# EAGLE design object_1_milling (EAGLE 7.7.0)
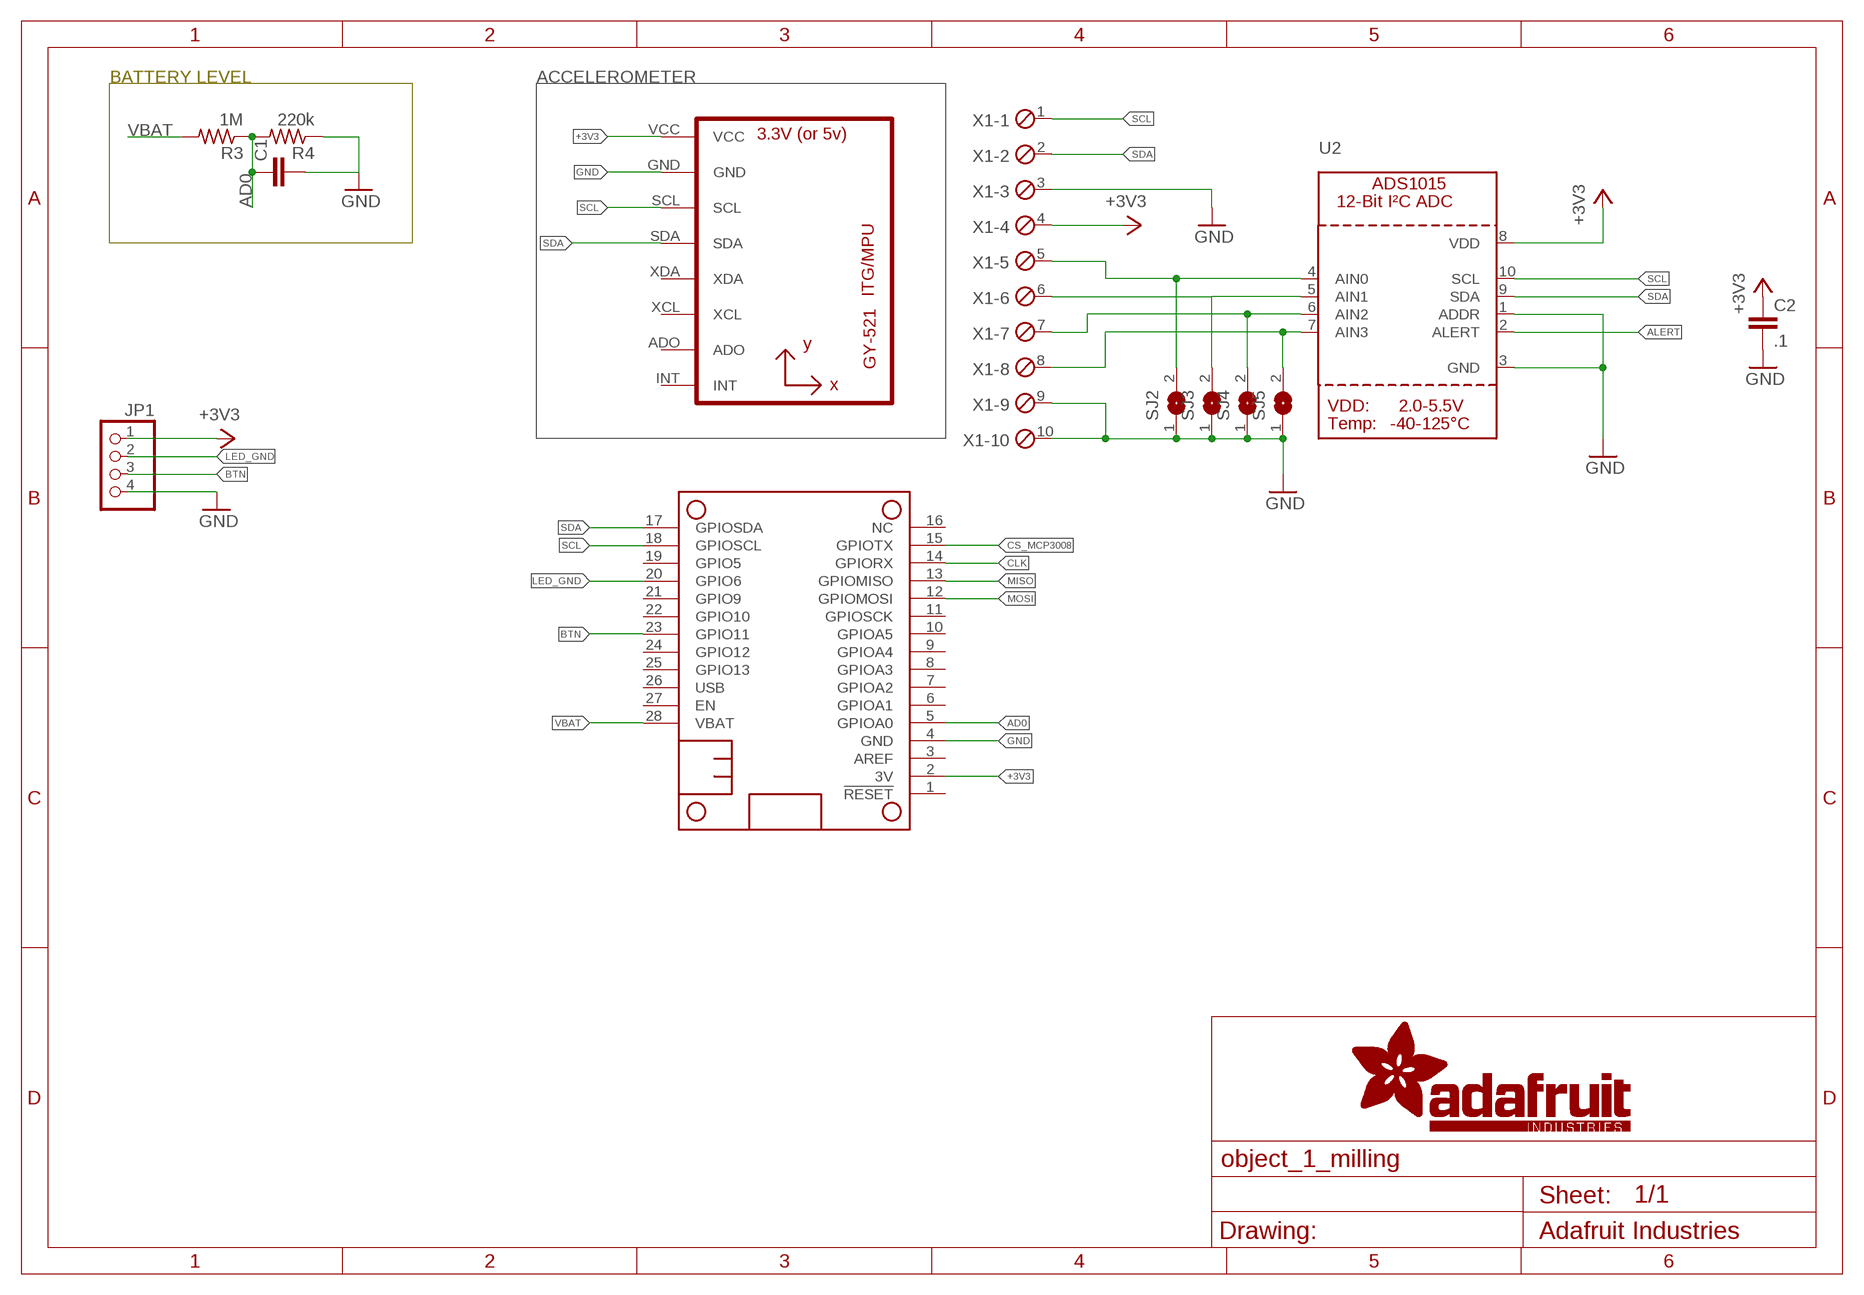
[diagram p0: schematic, sheet 1]

## Parts
C1  C-EUC0805K  [C0805K]
C2  .1  C-EUC0805K  [C0805K]
JP1  PINHD-1X4/90  [1X04/90]
MS1  FEATHERWING_NODIM  [FEATHERWING_DIM]
R3  1M  R-US_M0805  [M0805]
R4  220k  R-US_M0805  [M0805]
SJ2  SOLDERJUMPER  [SOLDERJUMPER_ARROW_NOPASTE]
SJ3  SOLDERJUMPER  [SOLDERJUMPER_ARROW_NOPASTE]
SJ4  SOLDERJUMPER  [SOLDERJUMPER_ARROW_NOPASTE]
SJ5  SOLDERJUMPER  [SOLDERJUMPER_ARROW_NOPASTE]
U1  GY-521MPU6050  [GY-521]
U2  ADC_ADS1015  [MSOP10]
X1  MPT10  [10POL254]

## Nets
+3V3: C2.1 JP1.1 MS1.2(3V) U1.VCC U2.8(VDD) X1.4
AD0: C1.1 MS1.5(GPIOA0) R3.1 R4.2
ALERT: U2.2(ALERT)
BTN: JP1.3 MS1.23(GPIO11)
CLK: MS1.14(GPIORX)
CS_MCP3008: MS1.15(GPIOTX)
GND: C1.2 C2.2 JP1.4 MS1.4(GND) R4.1 SJ2.1 SJ3.1 SJ4.1 SJ5.1 U1.GND U2.1(ADDR) U2.3(GND) X1.3 X1.9 X1.10
LED_GND: JP1.2 MS1.20(GPIO6)
MISO: MS1.13(GPIOMISO)
MOSI: MS1.12(GPIOMOSI)
N$2: SJ2.2 U2.4(AIN0) X1.5
N$3: SJ3.2 U2.5(AIN1) X1.6
N$4: SJ4.2 U2.6(AIN2) X1.7
N$5: SJ5.2 U2.7(AIN3) X1.8
SCL: MS1.18(GPIOSCL) U1.SCL U2.10(SCL) X1.1
SDA: MS1.17(GPIOSDA) U1.SDA U2.9(SDA) X1.2
VBAT: MS1.28(VBAT) R3.2
Unconnected: MS1.1(!RESET) MS1.3(AREF) MS1.6(GPIOA1) MS1.7(GPIOA2) MS1.8(GPIOA3) MS1.9(GPIOA4) MS1.10(GPIOA5) MS1.11(GPIOSCK) MS1.16(NC) MS1.19(GPIO5) MS1.21(GPIO9) MS1.22(GPIO10) MS1.24(GPIO12) MS1.25(GPIO13) MS1.26(USB) MS1.27(EN) U1.ADO U1.INT U1.XCL U1.XDA

## Notes on the sheet
- BATTERY LEVEL | ACCELEROMETER

## Library data of the parts
C1 C2 = rcl:C-EU: CAPACITOR, European symbol
JP1 = pinhead:PINHD-1X4: PIN HEADER
MS1 = adafruit:FEATHERWING
R3 R4 = resistor:R-US_: RESISTOR, American symbol
SJ2-SJ5 = microbuilder:SOLDERJUMPER: SMD Solder JUMPER Solder the two pads together to create a connection, or remove the solder to break it. REFLOW - Use this footprint for solder paste and reflow ovens. WAVE - Use this footprint for hand-soldering (larger pads). CLOSED - Has a trace between the two pads to ensure it is closed by default. The trace needs to be cut to disable the jumper, and can be closed again by creating a solder bridge between the two pads.; BOM: EXCLUDE
U1 = gy-521:GY-521
U2 = microbuilder:ADC_ADS1015: ADS1015 - 12-bit 4-Channel I2C ADC with Internal PGA VDD: 2.0-5.5V Sampling Rate: 3.3ksps Gain Settings: 2/3, 1, 2, 4, 8, 16 I2C Address: ADDR low = 1001000x, ADDR high = 1001001x Internal Comparator The ADS1015 includes an internal comparator that can be set to output a high-level on ALERT when the conversion results exceeeds a pre-defined upper level, and will deassert itself when the level falls below a pre-defined lower threshold level. It can also be set to windowed mode where the ALERT pin will be asserted if the data exceeds the upper threshold or falls below the lower threshold.
X1 = con-phoenix-254:MPT10: PHOENIX CONNECTOR; OC_FARNELL: unknown; OC_NEWARK: unknown

## Board
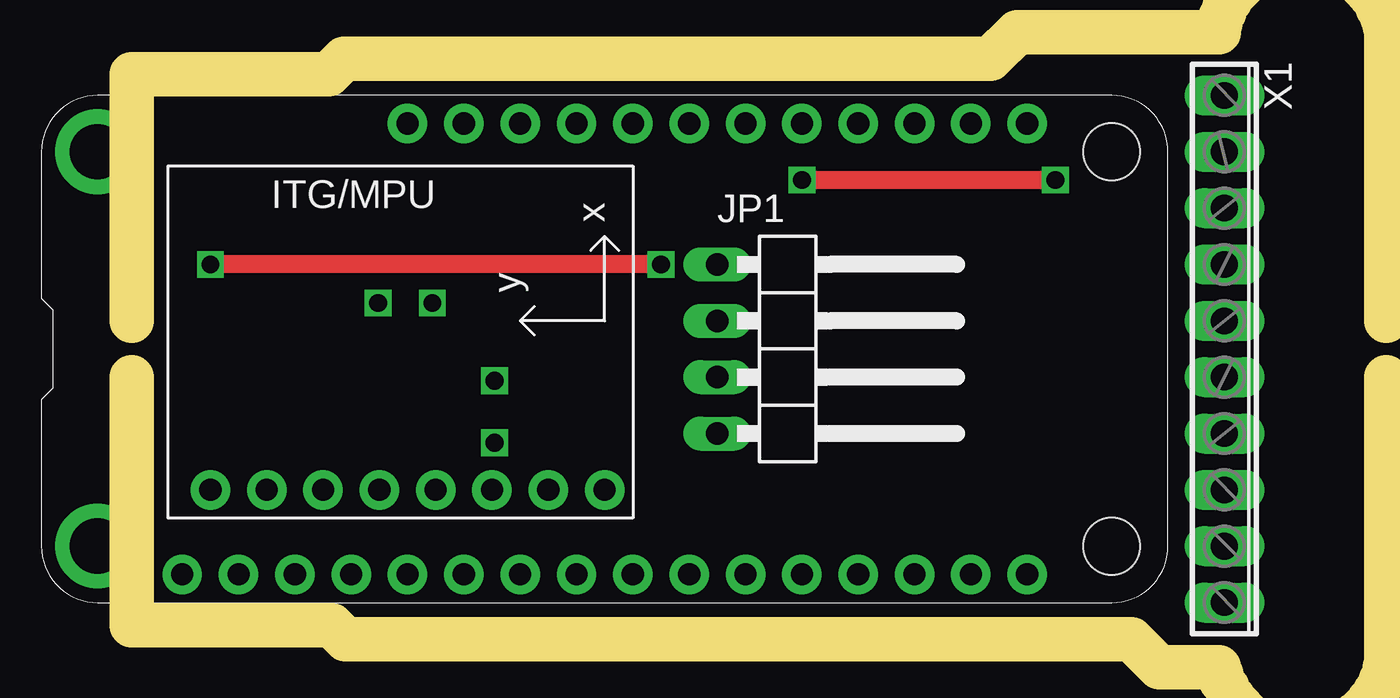
[diagram p1: board, top side]
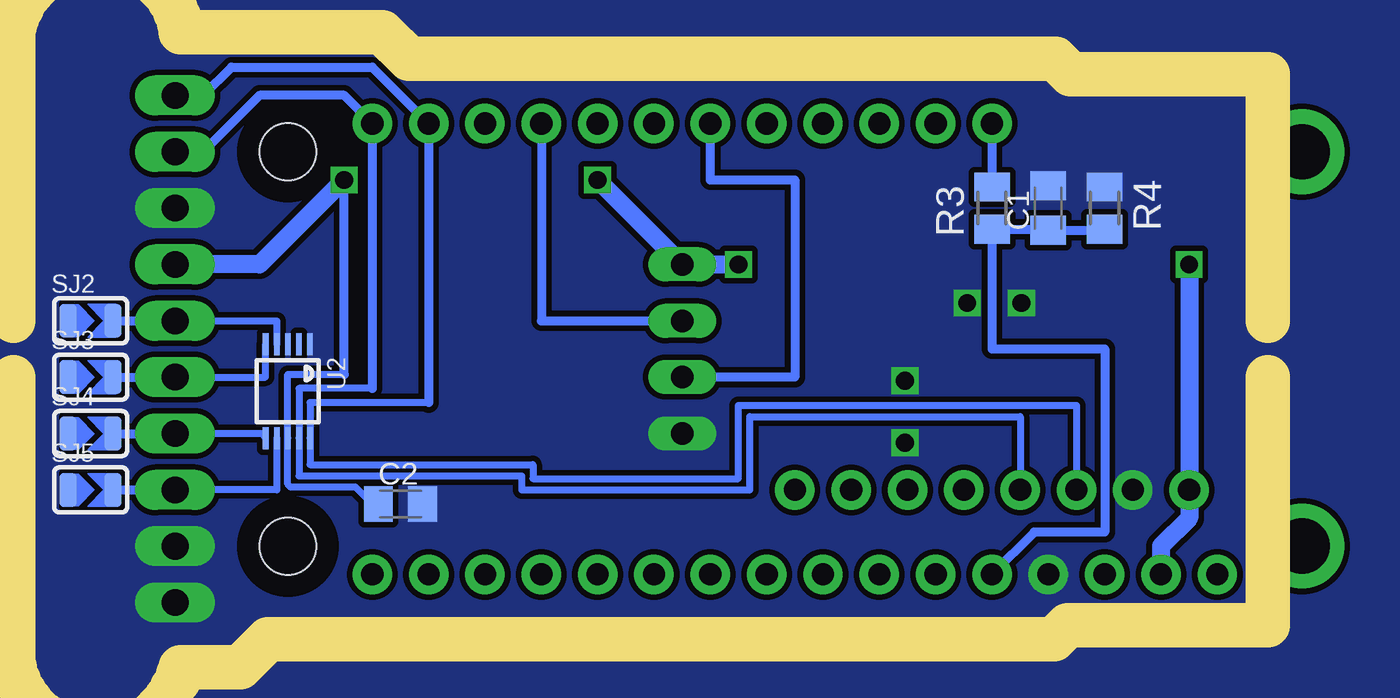
[diagram p2: board, bottom side, seen from below]

No outline drawn. Coordinates in mm, seen from the top.
Copper layers (1*16): Top 0.035mm / dielectric 1.5mm / Bottom 0.035mm
Design rules "default": minimum track width 10mil, minimum drill 24mil, track to track 8mil, track to pad 8mil, pad to pad 8mil, via to via 8mil, smd to smd 8mil, copper to edge 40mil, drill to drill 8mil, minimum pad ring 10mil, minimum via ring 8mil, stop-mask expansion 4mil, vias tented up to drill 0mil, thermal gap 10mil
Milling: 84 lines

### Footprints (pad centres in the part's own frame; a part is rotated, then mirrored left to right if it is on the bottom)
C0805K = smd 1.3 x 1.6: 1 -1,0; 2 1,0
1X04/90 = drill 1.016 long: 1 -3.81,-3.81; 2 -1.27,-3.81; 3 1.27,-3.81; 4 3.81,-3.81
FEATHERWING_DIM = drill 1 pad 1.778: 1 6.35,1.27; 2 8.89,1.27; 3 11.43,1.27; 4 13.97,1.27; 5 16.51,1.27; 6 19.05,1.27; 7 21.59,1.27; 8 24.13,1.27; 9 26.67,1.27; 10 29.21,1.27; 11 31.75,1.27; 12 34.29,1.27; 13 36.83,1.27; 14 39.37,1.27; 15 41.91,1.27; 16 44.45,1.27; 17 44.45,21.59; 18 41.91,21.59; 19 39.37,21.59; 20 36.83,21.59; 21 34.29,21.59; 22 31.75,21.59; 23 29.21,21.59; 24 26.67,21.59; 25 24.13,21.59; 26 21.59,21.59; 27 19.05,21.59; 28 16.51,21.59 | drill 2.5 pad 3.81: P$1 2.54,20.32; P$2 2.54,2.54 | hole 2.54: 48.26,20.32; 48.26,2.54
M0805 = smd 1.3 x 1.6: 1 -0.95,0; 2 0.95,0
SOLDERJUMPER_ARROW_NOPASTE = smd 0.762 x 1.524: 1 -1.016,0; 2 1.016,0
GY-521 = drill 1 pad 1.778: ADO -10.16,-6.35; GND -10.16,6.35; INT -10.16,-8.89; SCL -10.16,3.81; SDA -10.16,1.27; VCC -10.16,8.89; XCL -10.16,-3.81; XDA -10.16,-1.27
MSOP10 = smd 0.25 x 1: 1 -1,-2.113; 2 -0.5,-2.113; 3 0,-2.113; 4 0.5,-2.113; 5 1,-2.113; 6 1,2.113; 7 0.5,2.113; 8 0,2.113; 9 -0.5,2.113; 10 -1,2.113
10POL254 = drill 1.2 long: 1 -11.43,0; 2 -8.89,0; 3 -6.35,0; 4 -3.81,0; 5 -1.27,0; 6 1.27,0; 7 3.81,0; 8 6.35,0; 9 8.89,0; 10 11.43,0

### Placement (x,y rotation side)
C1  15.24,36.83 90 bottom
C2  44.45,23.5 0 bottom
JP1  35.56,30.48 270 top
MS1  1.27,19.05 0 top
R3  17.78,36.83 90 bottom
R4  12.7,36.83 270 bottom
SJ2  58.42,31.75 0 bottom
SJ3  58.42,29.21 0 bottom
SJ4  58.42,26.67 0 bottom
SJ5  58.42,24.13 0 bottom
U1  17.78,34.29 90 top
U2  49.53,28.57 180 bottom
X1  54.61,30.48 270 top

### Tracks (layer width: path | path; a pad name or v marks a point on that pad's centre or on a via)
+3V3  (via drill 0.8)
  Top 0.813: v35.56,38.1 v46.99,38.1 | v29.21,34.29 v8.89,34.29
  Bottom 0.305: 46.99,29.34 49.53,29.34 U2.8 49.53,24.38 49.4,24.26 46.48,24.26 45.72,23.5 C2.1
  Bottom 0.406: 46.99,29.34 v46.99,38.1
  Bottom 0.813: v35.56,38.1 JP1.1 v29.21,34.29 | v8.89,34.29 U1.VCC 8.89,22.86 10.16,21.59 MS1.2 | 53.34,34.29 X1.4 50.8,34.29 v46.99,38.1
AD0
  Bottom 0.406: R4.2 12.75,35.83 C1.1 15.29,35.88 R3.1 17.78,30.48 12.7,30.48 12.7,22.23 15.88,22.23 MS1.5
BTN
  Bottom 0.406: JP1.3 26.67,29.21 26.67,38.1 30.48,38.1 MS1.23
GND  (via drill 0.8)
  other vias: 16.45,32.55 18.9,32.55 21.7,29.05 21.7,26.25
  pour Bottom (isolate 0.254, no thermals): -1.27,10.16 66.04,10.16 66.04,52.07 -1.27,52.07
LED_GND
  Bottom 0.406: MS1.20 38.1,31.75 JP1.2
N$2
  Bottom 0.305: X1.5 50.03,31.75 U2.4
  Bottom 0.406: SJ2.2 X1.5
N$3
  Bottom 0.305: X1.6 50.53,29.21 U2.5
  Bottom 0.406: SJ3.2 X1.6
N$4
  Bottom 0.305: U2.6 50.66,26.67 X1.7
  Bottom 0.406: SJ4.2 X1.7
N$5
  Bottom 0.305: U2.7 50.03,24.13 X1.8
  Bottom 0.406: SJ5.2 X1.8
SCL
  Bottom 0.305: 43.18,28.07 48.53,28.07 U2.10 48.53,25.27 38.48,25.27 38.48,24.64 29.21,24.64 29.21,27.94 13.97,27.94 U1.SCL
  Bottom 0.406: 43.18,28.07 MS1.18 45.72,43.18 52.07,43.18 53.34,41.91 X1.1
SDA
  Bottom 0.305: 45.72,28.7 49.03,28.7 U2.9 49.03,24.77 38.99,24.77 38.99,24.13 28.7,24.13 28.7,27.43 16.51,27.43 U1.SDA
  Bottom 0.406: 45.72,28.7 MS1.17 46.99,41.91 50.8,41.91 53.34,39.37 X1.2
VBAT
  Bottom 0.406: MS1.28 R3.2